# Altium schematic sheet HapticFeedback.SchDoc
size Letter; CompanyName: Ploopy Corporation; Organization: Ploopy Corporation; Address1: Suite 226, 137-1140 Burnhamthorpe Road W; Address2: Mississauga; Address3: Ontario; Address4: Canada L5C 0A3; DocumentNumber: 3; Revision: R1.001; SheetNumber: 3; SheetTotal: 7
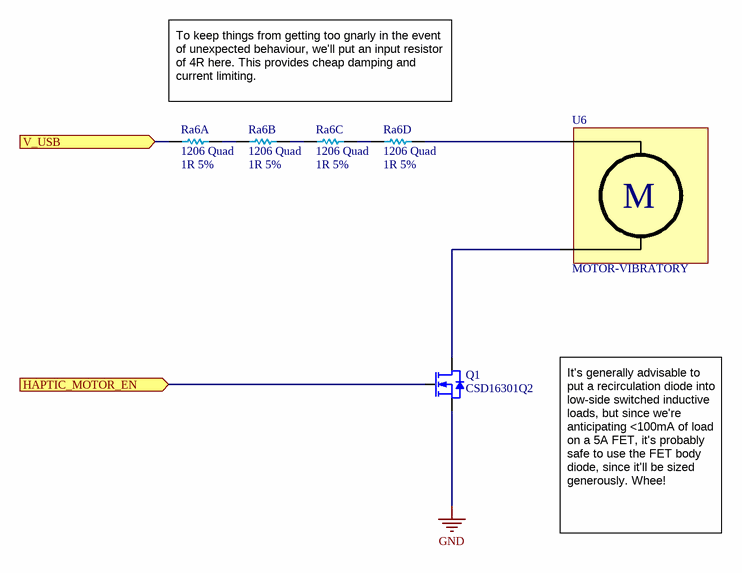
[diagram p0: HapticFeedback.SchDoc]

## Parts
Q1  CSD16301Q2  [CSD16301Q2 - SON65P200X80_HS-7M]
Ra6  1206 Quad  value 1R 5%  [4x 1R 5% - CAC-80P320X160-8M]  (parts A,B,C,D of 4)
U6  MOTOR-VIBRATORY  [MOTOR-VIBRATORY]

## Ports
HAPTIC_MOTOR_EN (in), V_USB (in)

## Nets
GND: Q1.S
HAPTIC_MOTOR_EN: Q1.G ; port HAPTIC_MOTOR_EN
V_USB: Ra6.1 ; port V_USB
NetQ1_D: Q1.D U6.2
NetRa6_2: Ra6.2 Ra6.8
NetRa6_3: Ra6.3 Ra6.7
NetRa6_4: Ra6.4 Ra6.6
NetRa6_5: Ra6.5 U6.1

## Notes on the sheet
- (near Ra6) To keep things from getting too gnarly in the event of unexpected behaviour, we'll put an input resistor of 4R here. This provides cheap damping and current limiting.
- It's generally advisable to put a recirculation diode into low-side switched inductive loads, but since we're anticipating <100mA of load on a 5A FET, it's probably safe to use the FET body diode, since it'll be sized generously. Whee!
- Copyright Ploopy Corporation 2024
- Licensed under the CERN-OHL-S v2
- http://ohwr.org/cernohl
- Title:
- PCB:
- Version:
- Ploopy Corporation
- Mississauga ON L5C 0A3
- 137-1140 Burnhamthorpe Road W
- Date:
- Time:
- Sheet
- of
- Canada
- (in symbol MOTOR-VIBRATORY) M

## Library data of the parts
Q1 = CSD16301Q2: 25-V N-Channel Power MOSFET, 20mOhm, 2nC Qg
Ra6 = Quad Res 1R 5% 1206: Chip resistor
U6 = MOTOR-VIBRATORY: A sort of bargain basement miscellaneous kind of vibration motor that can be found on AliExpress. It has springs for connecting directly to a PCB.